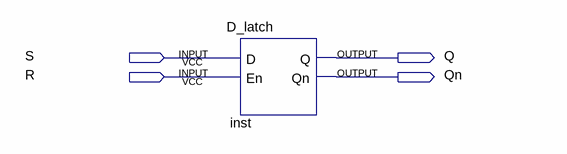
[diagram p0: schematic sheet]
// Quartus schematic L0701.bdf as structural Verilog: 1 symbols, 4 pins
module L0701 (
  input  S,
  input  R,
  output Q,
  output Qn
);

  D_latch inst (.D(S), .En(R), .Q(Q), .Qn(Qn));
endmodule
